# EAGLE design Transmitter_edge_trigger (EAGLE 6.5.0)
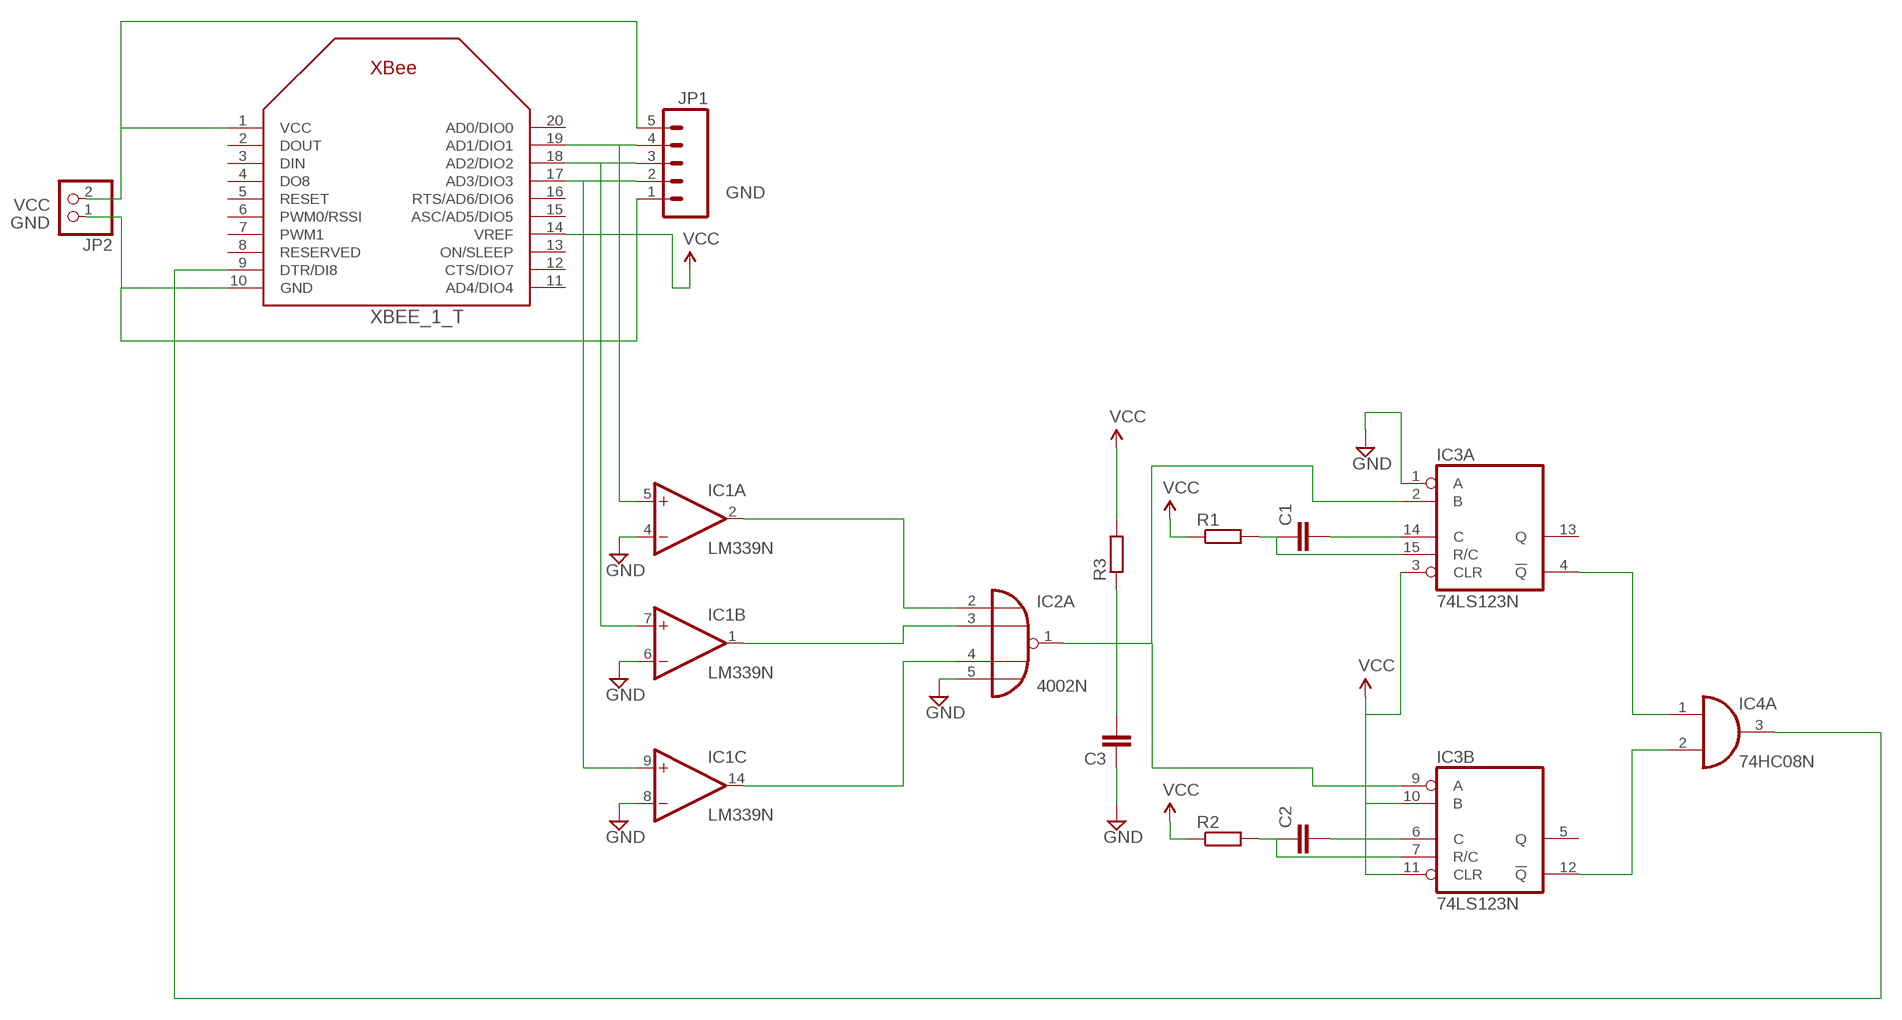
[diagram p0: schematic, sheet 1]

## Parts
C1  C-EU025-030X050  [C025-030X050]
C2  C-EU025-030X050  [C025-030X050]
C3  C-EU025-030X050  [C025-030X050]
IC1  LM339N  [DIL14]
IC2  4002N  [DIL14]
IC3  74LS123N  [DIL16]
IC4  74HC08N  [DIL14]
JP1  M05PTH  [1X05]
JP2  PINHD-1X2  [1X02]
R1  R-EU_0207/12  [0207/12]
R2  R-EU_0207/12  [0207/12]
R3  R-EU_0207/12  [0207/12]
XBEE_1_T  XBEE  [XBEE]

## Nets
GND: C3.1 IC1.4(A:-IN) IC1.6(B:-IN) IC1.8(C:-IN) IC2.5(A:I3) IC3.1(A:A) JP1.1 JP2.1 XBEE_1_T.10(GND)
N$2: IC1.5(A:+IN) JP1.4 XBEE_1_T.19(AD1/DIO1)
N$5: IC1.2(A:OUT) IC2.2(A:I0)
N$6: IC1.1(B:OUT) IC2.3(A:I1)
N$7: IC1.14(C:OUT) IC2.4(A:I2)
N$8: C3.2 IC2.1(A:O) IC3.2(A:B) IC3.9(B:A) R3.1
N$9: C1.2 IC3.14(A:C)
N$10: C1.1 IC3.15(A:R/C) R1.2
N$11: C2.1 IC3.7(B:R/C) R2.2
N$12: C2.2 IC3.6(B:C)
N$13: IC3.4(A:!Q) IC4.1(A:I0)
N$14: IC3.12(B:!Q) IC4.2(A:I1)
N$15: IC4.3(A:O) XBEE_1_T.9(DTR/DI8)
N$16: IC1.9(C:+IN) JP1.2 XBEE_1_T.17(AD3/DIO3)
N$17: IC1.7(B:+IN) JP1.3 XBEE_1_T.18(AD2/DIO2)
VCC: IC3.3(A:CLR) IC3.10(B:B) IC3.11(B:CLR) JP1.5 JP2.2 R1.1 R2.1 R3.2 XBEE_1_T.1(VCC) XBEE_1_T.14(VREF)
Unconnected: IC1.10(D:-IN) IC1.11(D:+IN) IC1.13(D:OUT) IC2.9(B:I0) IC2.10(B:I1) IC2.11(B:I2) IC2.12(B:I3) IC2.13(B:O) IC3.5(B:Q) IC3.13(A:Q) IC4.4(B:I0) IC4.5(B:I1) IC4.6(B:O) IC4.8(C:O) IC4.9(C:I0) IC4.10(C:I1) IC4.11(D:O) IC4.12(D:I0) IC4.13(D:I1) XBEE_1_T.2(DOUT) XBEE_1_T.3(DIN) XBEE_1_T.4(DO8) XBEE_1_T.5(RESET) XBEE_1_T.6(PWM0/RSSI) XBEE_1_T.7(PWM1) XBEE_1_T.8(RESERVED) XBEE_1_T.11(AD4/DIO4) XBEE_1_T.12(CTS/DIO7) XBEE_1_T.13(ON/SLEEP) XBEE_1_T.15(ASC/AD5/DIO5) XBEE_1_T.16(RTS/AD6/DIO6) XBEE_1_T.20(AD0/DIO0)

## Power pins joined to a net without a drawn wire
GND: IC1.12(P:GND) IC3.8(P:GND) IC4.7(P:GND)
V+: IC1.3(P:V+)
VCC: IC3.16(P:VCC) IC4.14(P:VCC)
VDD: IC2.14(P:VDD)
VSS: IC2.7(P:VSS)

## Library data of the parts
C1-C3 = rcl:C-EU: CAPACITOR, European symbol
IC1 = linear:LM339: Low Power Low Offset Voltage Quad Comparators with open collector; LM139/LM239/LM339/LM2901/LM3302
IC2 = 40xx:4002: 4-input NOR
IC3 = 74xx-eu:74*123: Retriggerable monostable MULTIVIBRATOR
IC4 = 74xx-eu:74*08: Quad 2-input AND gate
JP1 = SparkFun-Connectors:M05: Header 5 Standard 5-pin 0.1" header. Use with straight break away headers (SKU : PRT-00116), right angle break away headers (PRT-00553), swiss pins (PRT-00743), machine pins (PRT-00117), and female headers (PRT-00115). Molex polarized connector foot print use with SKU : PRT-08230 with associated crimp pins and housings.
JP2 = pinhead:PINHD-1X2: PIN HEADER
R1-R3 = resistor:R-EU_: RESISTOR, European symbol
XBEE_1_T = adafruit:XBEE

## Board
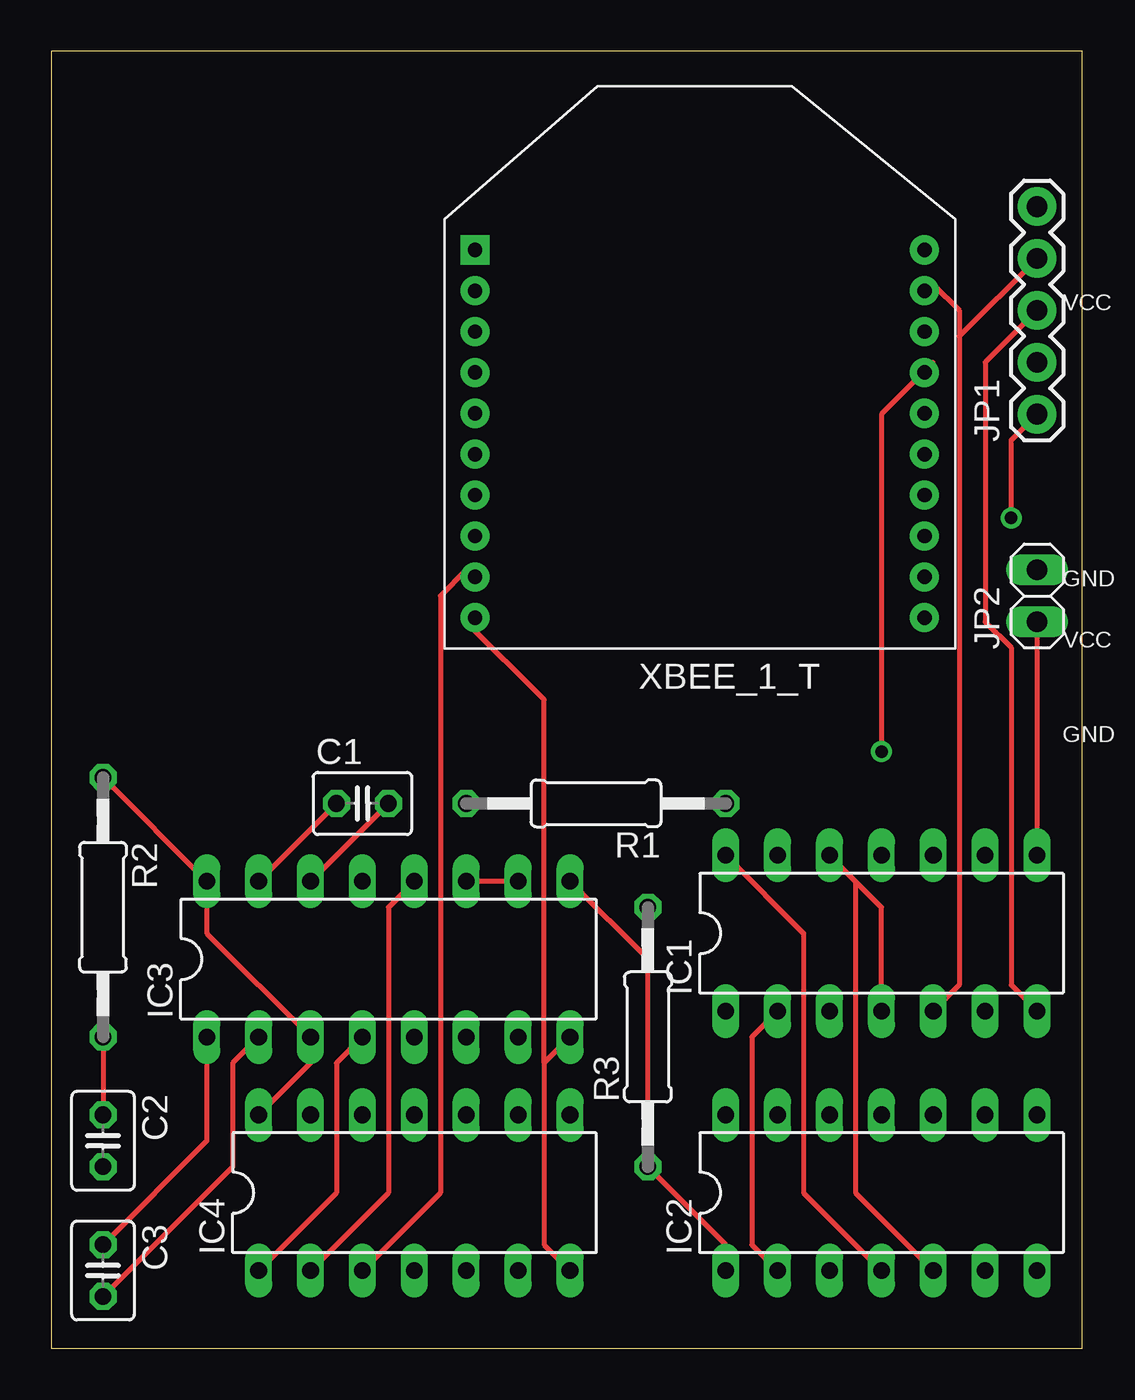
[diagram p1: board, top side]
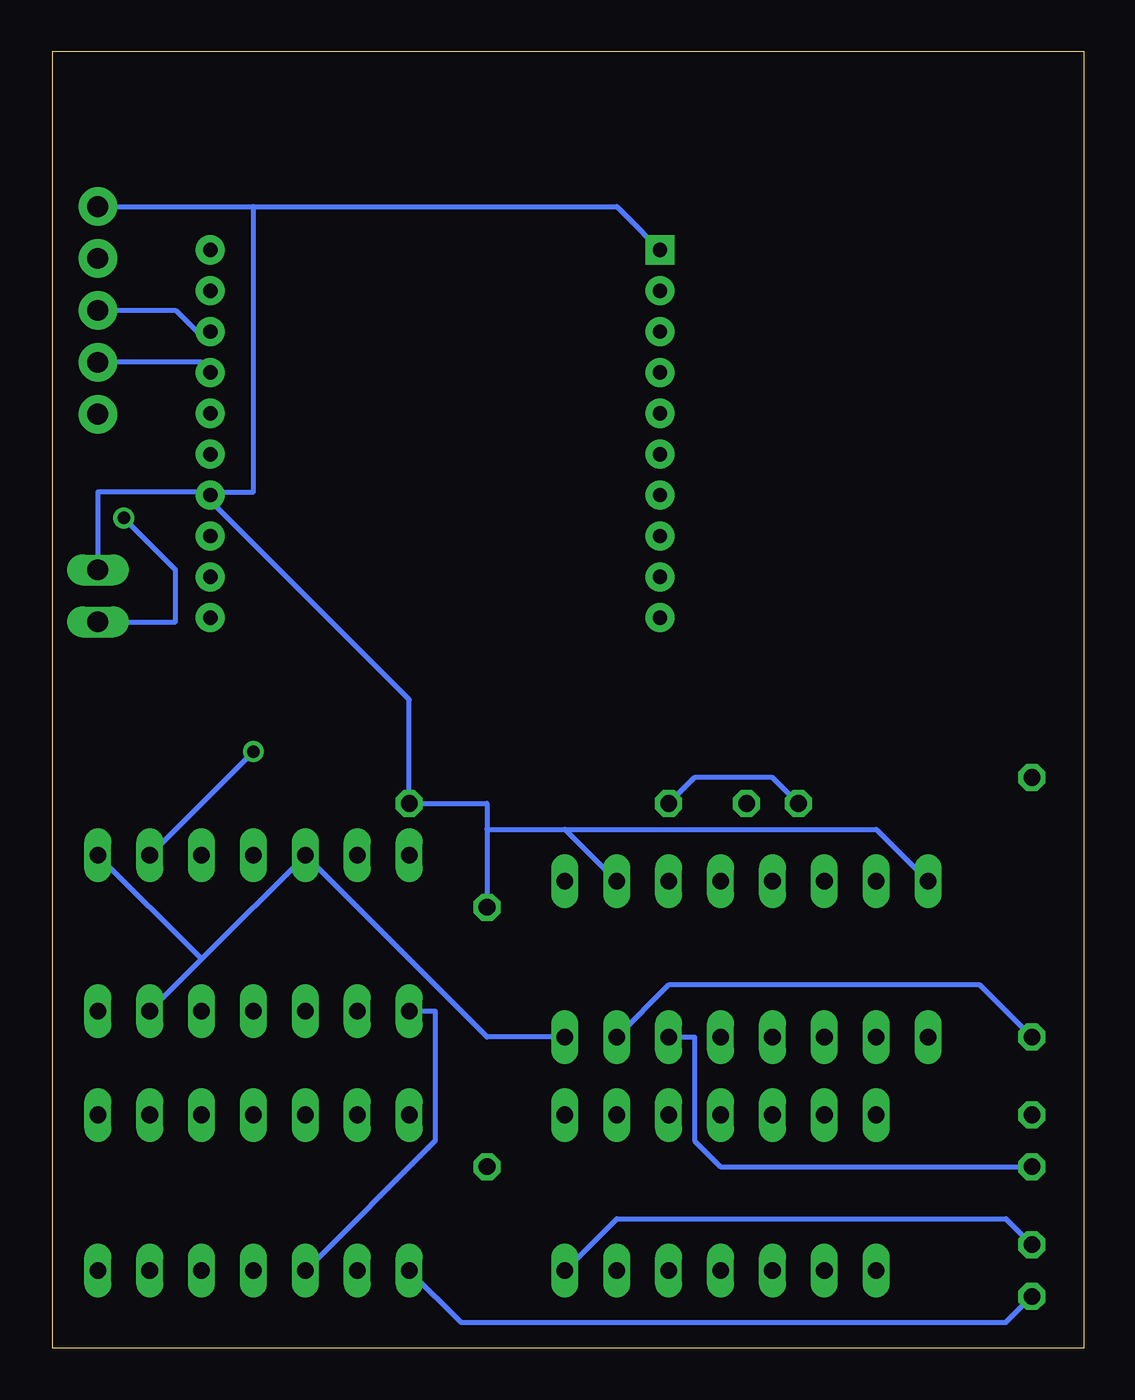
[diagram p2: board, bottom side, seen from below]

Size 50.47 x 63.49 mm. Coordinates in mm from the lower left corner, seen from the top.
Outline: 0,0 50.47,0 50.47,63.49 0,63.49 0,0
Copper layers (1*16): Top 0.035mm / dielectric 1.5mm / Bottom 0.035mm
Design rules "default": minimum track width 10mil, minimum drill 24mil, track to track 8mil, track to pad 8mil, pad to pad 8mil, via to via 8mil, smd to smd 8mil, copper to edge 40mil, drill to drill 8mil, minimum pad ring 10mil, minimum via ring 8mil, stop-mask expansion 4mil, vias tented up to drill 0mil, thermal gap 10mil

### Footprints (pad centres in the part's own frame; a part is rotated, then mirrored left to right if it is on the bottom)
C025-030X050 = drill 0.813 octagon: 1 -1.27,0; 2 1.27,0
DIL14 = drill 0.813 long: 1 -7.62,-3.81; 2 -5.08,-3.81; 3 -2.54,-3.81; 4 0,-3.81; 5 2.54,-3.81; 6 5.08,-3.81; 7 7.62,-3.81; 8 7.62,3.81; 9 5.08,3.81; 10 2.54,3.81; 11 0,3.81; 12 -2.54,3.81; 13 -5.08,3.81; 14 -7.62,3.81
DIL16 = drill 0.813 long: 1 -8.89,-3.81; 2 -6.35,-3.81; 3 -3.81,-3.81; 4 -1.27,-3.81; 5 1.27,-3.81; 6 3.81,-3.81; 7 6.35,-3.81; 8 8.89,-3.81; 9 8.89,3.81; 10 6.35,3.81; 11 3.81,3.81; 12 1.27,3.81; 13 -1.27,3.81; 14 -3.81,3.81; 15 -6.35,3.81; 16 -8.89,3.81
1X05 = drill 1.016 pad 1.88: 1 0,0; 2 2.54,0; 3 5.08,0; 4 7.62,0; 5 10.16,0
1X02 = drill 1.016 long: 1 -1.27,0; 2 1.27,0
0207/12 = drill 0.813 octagon: 1 -6.35,0; 2 6.35,0
XBEE = drill 0.7 pad 1.422 square: 1 -11,5.5 | drill 0.7 pad 1.422: 2 -11,3.5; 3 -11,1.5; 4 -11,-0.5; 5 -11,-2.5; 6 -11,-4.5; 7 -11,-6.5; 8 -11,-8.5; 9 -11,-10.5; 10 -11,-12.5; 11 11,-12.5; 12 11,-10.5; 13 11,-8.5; 14 11,-6.5; 15 11,-4.5; 16 11,-2.5; 17 11,-0.5; 18 11,1.5; 19 11,3.5; 20 11,5.5

### Placement (x,y rotation side)
C1  15.24,26.67 0 top
C2  2.54,10.16 270 top
C3  2.54,3.81 270 top
IC1  40.64,20.32 0 top
IC2  40.64,7.62 0 top
IC3  16.51,19.05 0 top
IC4  17.78,7.62 0 top
JP1  48.26,45.72 90 top
JP2  48.26,36.83 90 top
R1  26.67,26.67 180 top
R2  2.54,21.59 270 top
R3  29.21,15.24 90 top
XBEE_1_T  31.75,48.26 0 top

### Tracks (layer width: path | path; a pad name or v marks a point on that pad's centre or on a via)
GND  (via drill 0.61)
  Top 0.254: 39.37,22.86 40.64,21.59 IC1.4 | 39.37,22.86 IC1.12 | IC2.5 39.37,7.62 39.37,22.86 | IC1.8 JP2.1 | JP1.1 46.99,44.45 v46.99,40.64 | C3.1 7.62,10.16 IC3.1 | IC4.7 24.13,5.08 24.13,13.97 | IC3.8 24.13,13.97 | 24.13,13.97 24.13,31.75 20.32,35.56 XBEE_1_T.10
  Bottom 0.254: 43.18,19.05 IC1.12 29.21,15.24 IC3.8 | 43.18,19.05 IC1.6 | 43.18,19.05 IC1.8 | v46.99,40.64 44.45,38.1 44.45,35.56 JP2.1 | C3.1 3.81,6.35 22.86,6.35 IC4.7
N$2
  Top 0.254: IC1.5 44.45,17.78 44.45,49.53 | 44.45,49.53 44.45,50.8 43.18,52.07 XBEE_1_T.19 | 44.45,49.53 JP1.4
N$5
  Top 0.254: IC2.2 34.29,5.08 34.29,15.24 IC1.2
N$6
  Bottom 0.254: IC2.3 31.75,10.16 31.75,16.51 IC1.1
N$7
  Top 0.254: IC2.4 36.83,7.62 36.83,20.32 IC1.14
N$8
  Top 0.254: C3.2 8.89,8.89 8.89,13.97 IC3.2 | IC2.1 33.02,5.08 R3.1 29.21,19.05 IC3.9
  Bottom 0.254: C3.2 3.81,1.27 30.48,1.27 IC2.1
N$9
  Top 0.254: C1.2 IC3.14
N$10
  Top 0.254: C1.1 IC3.15
  Bottom 0.254: R1.2 19.05,27.94 15.24,27.94 C1.1
N$11
  Top 0.254: R2.2 C2.1
  Bottom 0.254: IC3.7 20.32,17.78 5.08,17.78 R2.2
N$12
  Bottom 0.254: C2.2 17.78,8.89 19.05,10.16 19.05,15.24 IC3.6
N$13
  Top 0.254: IC4.1 13.97,7.62 13.97,13.97 IC3.4
N$14
  Top 0.254: IC4.2 16.51,7.62 16.51,21.59 IC3.12
N$15
  Top 0.254: IC4.3 19.05,7.62 19.05,36.83 20.32,38.1 XBEE_1_T.9
N$16  (via drill 0.61)
  Top 0.254: v40.64,29.21 40.64,45.72 43.18,48.26 XBEE_1_T.17
  Bottom 0.254: v40.64,29.21 IC1.9 | JP1.2 43.18,48.26 XBEE_1_T.17
N$17
  Top 0.254: IC1.7 46.99,17.78 46.99,34.29 45.72,35.56 45.72,48.26 JP1.3
  Bottom 0.254: JP1.3 44.45,50.8 43.18,49.53 XBEE_1_T.18
VCC
  Top 0.254: IC4.14 12.7,13.97 IC3.3 7.62,20.32 IC3.16 R2.1 | IC3.10 IC3.11
  Bottom 0.254: JP1.5 40.64,55.88 | 40.64,55.88 22.86,55.88 20.32,53.34 XBEE_1_T.1 | 29.21,25.4 29.21,26.67 R1.1 33.02,31.75 43.18,41.91 | 29.21,25.4 R3.2 | JP2.2 48.26,41.91 43.18,41.91 | 25.4,25.4 IC3.10 | 29.21,25.4 25.4,25.4 | IC3.16 10.16,25.4 25.4,25.4 | 40.64,55.88 40.64,41.91 43.18,41.91 | 43.18,41.91 XBEE_1_T.14

### Text on the board
tNames: VCC | GND | VCC | GND